# EAGLE design cwm__ (EAGLE 7.5.0)
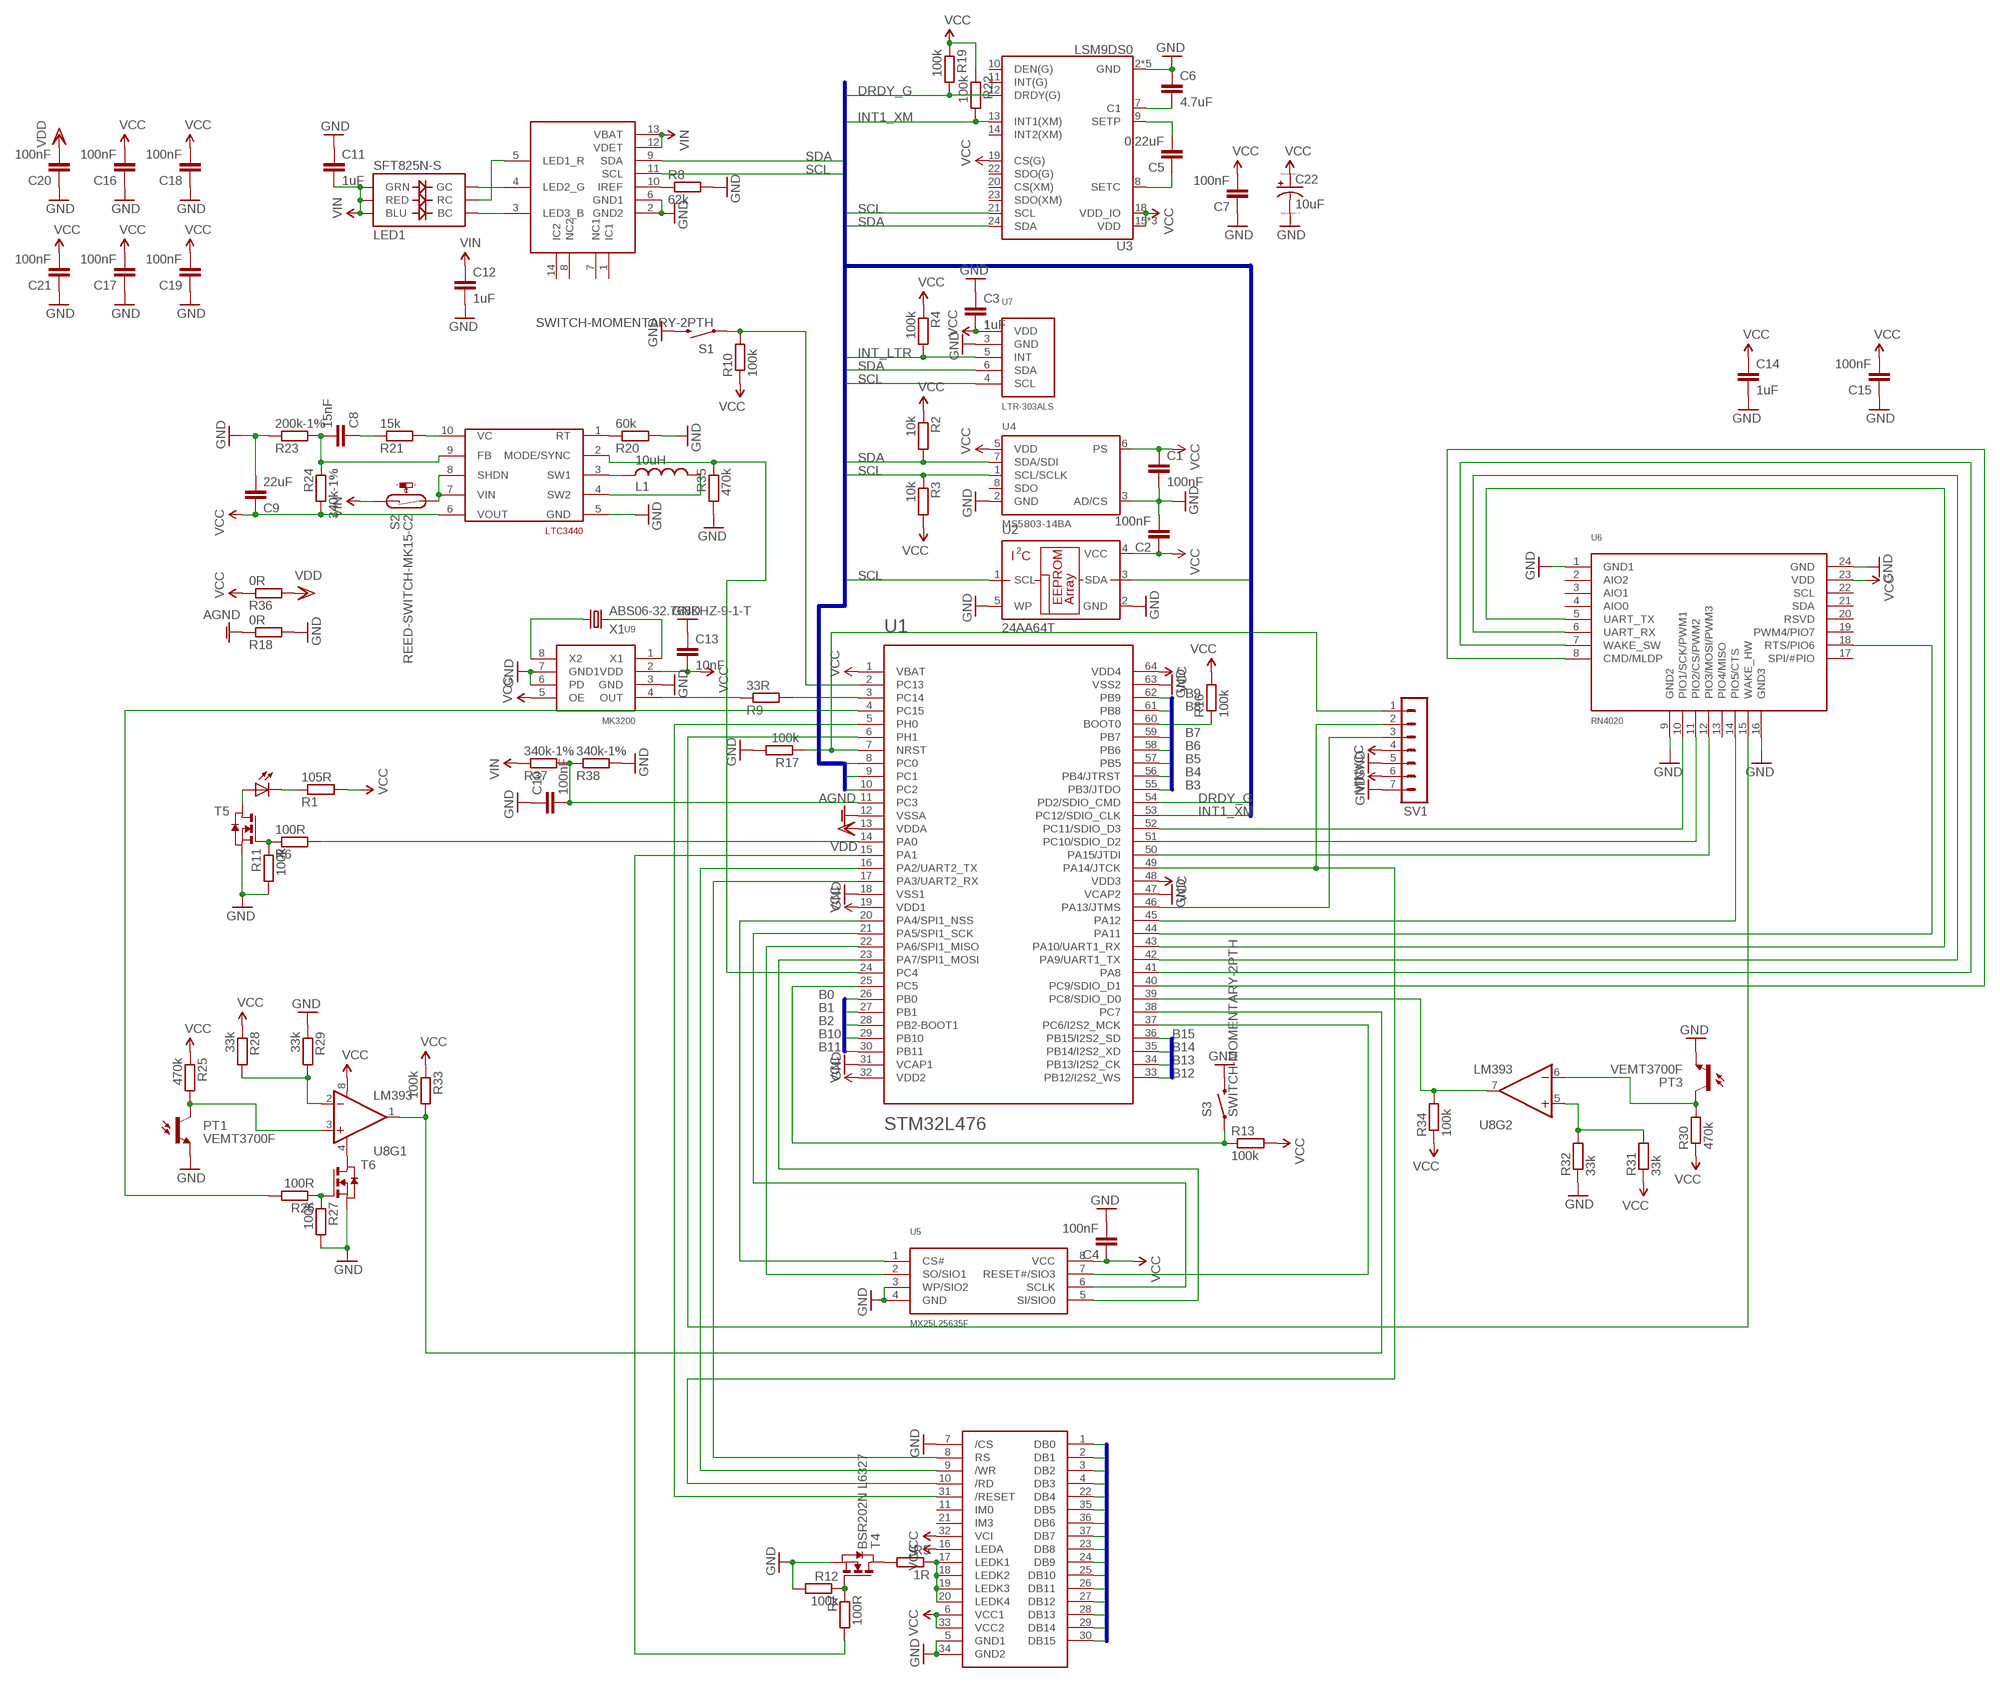
[diagram p0: schematic, sheet 1]

## Parts
C1  100nF  C-EUC0402  [C0402]
C2  100nF  C-EUC0402  [C0402]
C3  1uF  C-EUC0603  [C0603]
C4  100nF  C-EUC0402  [C0402]
C5  0.22uF  C-EUC0402  [C0402]
C6  4.7uF  C-EUC0805  [C0805]
C7  100nF  C-EUC0402  [C0402]
C8  15nF  C-EUC0402  [C0402]
C9  22uF  C-EUC0805  [C0805]
C10  100nF  C-EUC0402  [C0402]
C11  1uF  C-EUC0603  [C0603]
C12  1uF  C-EUC0603  [C0603]
C13  10nF  C-EUC0402  [C0402]
C14  1uF  C-EUC0603  [C0603]
C15  100nF  C-EUC0402  [C0402]
C16  100nF  C-EUC0402  [C0402]
C17  100nF  C-EUC0402  [C0402]
C18  100nF  C-EUC0402  [C0402]
C19  100nF  C-EUC0402  [C0402]
C20  100nF  C-EUC0402  [C0402]
C21  100nF  C-EUC0402  [C0402]
C22  10uF  CPOL-USA/3216-18R  [A/3216-18R]
L1  10uH  L-USL3225M  [L3225M]
LED1  SFT825N-S  LED-TRICOLOR-NO-COMPLCC-6-SMD  [PLCC-6-LED]
PT1  VEMT3700F  [PLCC-2]
PT3  VEMT3700F  [PLCC-2]
R1  105R  R-EU_R0402  [R0402]
R2  10k  R-EU_R0402  [R0402]
R3  10k  R-EU_R0402  [R0402]
R4  100k  R-EU_R0402  [R0402]
R5  1R  R-EU_R0402  [R0402]
R6  100R  R-EU_R0402  [R0402]
R7  100R  R-EU_R0402  [R0402]
R8  62k  R-EU_R0402  [R0402]
R9  33R  R-EU_R0402  [R0402]
R10  100k  R-EU_R0402  [R0402]
R11  100k  R-EU_R0402  [R0402]
R12  100k  R-EU_R0402  [R0402]
R13  100k  R-EU_R0402  [R0402]
R16  100k  R-EU_R0402  [R0402]
R17  100k  R-EU_R0402  [R0402]
R18  0R  R-EU_R0402  [R0402]
R19  100k  R-EU_R0402  [R0402]
R20  60k  R-EU_R0402  [R0402]
R21  15k  R-EU_R0402  [R0402]
R22  100k  R-EU_R0402  [R0402]
R23  200k-1%  R-EU_R0402  [R0402]
R24  340k-1%  R-EU_R0402  [R0402]
R25  470k  R-EU_R0402  [R0402]
R26  100R  R-EU_R0402  [R0402]
R27  100k  R-EU_R0402  [R0402]
R28  33k  R-EU_R0402  [R0402]
R29  33k  R-EU_R0402  [R0402]
R30  470k  R-EU_R0402  [R0402]
R31  33k  R-EU_R0402  [R0402]
R32  33k  R-EU_R0402  [R0402]
R33  100k  R-EU_R0402  [R0402]
R34  100k  R-EU_R0402  [R0402]
R35  470k  R-EU_R0402  [R0402]
R36  0R  R-EU_R0402  [R0402]
R37  340k-1%  R-EU_R0402  [R0402]
R38  340k-1%  R-EU_R0402  [R0402]
S1  SWITCH-MOMENTARY-2PTH  [TACTILE-PTH]
S2  REED-SWITCH-MK15-C2  [MK15]
S3  SWITCH-MOMENTARY-2PTH  [TACTILE-PTH]
SV1  MA07-1  [MA07-1]
T4  BSR202N L6327  NMOSSOT23  [SOT-23]
T5  NMOSSOT23  [SOT-23]
T6  NMOSSOT23  [SOT-23]
U1  STM32L476  STM32F405RG  [TQFP64]
U2  24AA64T  24AA00OT  [SOT23-5L]
U3  LSM9DS0  [LGA-24]
U4  MS5803-14BA  [MS5803]
U5  MX25L25635F  [WSON8L]
U6  RN4020  [RN4020]
U7  LTR-303ALS  [LTR-303ALS]
U8  LM393  [SO08]
U9  MK3200  [SOIC8]
U$1  S95466-AAA  [S95466-AAA]
U$2  VSML3710  [PLCC-2]
U$3  NCP5623  [NCP5623]
U$9  LTC3440  [MSOP10]
X1  ABS06-32.768KHZ-9-1-T  CRYSTALS-NOGND-IQXC-25  [2.0X1.2-2PAD]

## Nets
AGND: R18.1 U1.12(VSSA)
B0: U1.26(PB0) U$1.1(DB0)
B1: U1.27(PB1) U$1.2(DB1)
B2: U1.28(PB2-BOOT1) U$1.3(DB2)
B3: U1.55(PB3/JTDO) U$1.4(DB3)
B4: U1.56(PB4/JTRST) U$1.22(DB4)
B5: U1.57(PB5) U$1.35(DB5)
B6: U1.58(PB6) U$1.36(DB6)
B7: U1.59(PB7) U$1.37(DB7)
B8: U1.61(PB8) U$1.23(DB8)
B9: U1.62(PB9) U$1.24(DB9)
B10: U1.29(PB10) U$1.25(DB10)
B11: U1.30(PB11) U$1.26(DB11)
B12: U1.33(PB12/I2S2_WS) U$1.27(DB12)
B13: U1.34(PB13/I2S2_CK) U$1.28(DB13)
B14: U1.35(PB14/I2S2_XD) U$1.29(DB14)
B15: U1.36(PB15/I2S2_SD) U$1.30(DB15)
DRDY_G: R19.2 U1.54(PD2/SDIO_CMD) U3.12(DRDY(G))
GND [GND]: C1.2 C2.2 C3.1 C4.2 C6.1 C7.1 C9.2 C10.1 C11.1 C12.2 C13.1 C14.2 C15.1 C16.1 C17.1 C18.1 C19.1 C20.1 C21.1 C22.- PT1.P$2(E) PT3.P$2(E) R8.2 R11.2 R12.2 R17.2 R18.2 R20.2 R23.1 R27.2 R29.1 R32.1 R35.2 R38.2 S1.3 S3.3 SV1.5 SV1.7 T4.2(S) T5.2(S) T6.2(S) U1.18(VSS1) U1.31(VCAP1) U1.47(VCAP2) U1.63(VSS2) U2.2(GND) U2.5(WP) U3.2(GND) U3.3(GND) U3.4(GND) U3.5(GND) U3.6(GND) U4.2(GND) U4.3(AD/CS) U5.3(WP/SIO2) U5.4(GND) U6.1(GND1) U6.9(GND2) U6.16(GND3) U6.24(GND) U7.3(GND) U9.3(GND) U9.6(PD) U9.7(GND1) U$1.5(GND1) U$1.7(/CS) U$1.34(GND2) U$3.2(GND2) U$3.6(GND1) U$9.5(GND)
INT1_XM: R22.2 U1.53(PC12/SDIO_CLK) U3.13(INT1(XM))
INT_LTR: R4.2 U1.10(PC2) U7.5(INT)
N$1 [VIN]: S2.2 U$9.7(VIN) U$9.8(SHDN)
N$2: R5.1 U$1.17(LEDK1) U$1.18(LEDK2) U$1.19(LEDK3) U$1.20(LEDK4)
N$3: T5.1(D) U$2.P$2(A)
N$4: C5.2 U3.9(SETP)
N$5: U1.6(PH1) U6.15(WAKE_HW)
N$6: U1.17(PA3/UART2_RX) U$1.8(RS)
N$7: U1.5(PH0) U$1.31(/RESET)
N$8: U1.16(PA2/UART2_TX) U$1.9(/WR)
N$9: R35.1 U1.24(PC4) U$9.2(MODE/SYNC)
N$10: R5.2 T4.1(D)
N$11: LED1.CG(GC) U$3.4(LED2_G)
N$12: LED1.CB(BC) U$3.3(LED3_B)
N$13: LED1.CR(RC) U$3.5(LED1_R)
N$14: R1.1 U$2.P$1(C)
N$15: R6.1 R11.1 T5.3(G)
N$16: R6.2 U1.14(PA0)
N$17: R7.1 R12.1 T4.3(G)
N$18: R7.2 U1.15(PA1)
N$19: U9.1(X1) X1.2
N$20: R8.1 U$3.10(IREF)
N$21: U9.8(X2) X1.1
N$22: R9.1 U9.4(OUT)
N$23: SV1.2 U1.49(PA14/JTCK) U$1.10(/RD)
N$24: R10.2 S1.1 U1.2(PC13)
N$25: R13.1 S3.1 U1.25(PC5)
N$26: R9.2 U1.3(PC14)
N$27: U1.42(PA9/UART1_TX) U6.6(UART_RX)
N$28: L1.2 U$9.3(SW1)
N$29: L1.1 U$9.4(SW2)
N$30: C5.1 U3.8(SETC)
N$31: C6.2 U3.7(C1)
N$32: T6.1(D) U8.4(V-)
N$33: PT1.P$1(C) R25.2 U8.3(+IN)
N$34: R28.2 R29.2 U8.2(-IN)
N$35: R17.1 SV1.1 U1.7(NRST)
N$36: R16.1 U1.60(BOOT0)
N$37: PT3.P$1(C) R30.2 U8.6(-IN)
N$38: R26.1 R27.1 T6.3(G)
N$39: R26.2 U1.4(PC15)
N$40: R31.2 R32.2 U8.5(+IN)
N$41: R33.2 U1.38(PC7) U8.1(OUT)
N$42: R34.2 U1.39(PC8/SDIO_D0) U8.7(OUT)
N$43: U1.43(PA10/UART1_RX) U6.5(UART_TX)
N$44: U1.44(PA11) U6.18(RTS/PIO6)
N$45: U1.45(PA12) U6.14(PIO5/CTS)
N$46: U1.40(PC9/SDIO_D1) U6.8(CMD/MLDP)
N$47: U1.41(PA8) U6.7(WAKE_SW)
N$48: SV1.3 U1.46(PA13/JTMS)
N$49: U1.52(PC11/SDIO_D3) U6.10(PIO1/SCK/PWM1)
N$50: U1.51(PC10/SDIO_D2) U6.11(PIO2/CS/PWM2)
N$51: U1.50(PA15/JTDI) U6.12(PIO3/MOSI/PWM3)
N$52: R20.1 U$9.1(RT)
N$53: U1.20(PA4/SPI1_NSS) U5.1(CS#)
N$54: U1.22(PA6/SPI1_MISO) U5.2(SO/SIO1)
N$55: U1.37(PC6/I2S2_MCK) U5.7(RESET#/SIO3)
N$56: U1.21(PA5/SPI1_SCK) U5.6(SCLK)
N$57: U1.23(PA7/SPI1_MOSI) U5.5(SI/SIO0)
N$58: C10.2 R37.2 R38.1 U1.11(PC3)
N$70: C8.2 R23.2 R24.1 U$9.9(FB)
N$73: R21.2 U$9.10(VC)
N$74: C8.1 R21.1
SCL: R3.1 U1.8(PC0) U2.1(SCL) U3.21(SCL) U4.1(SCL/SCLK) U7.4(SCL) U$3.11(SCL)
SDA: R2.2 U1.9(PC1) U2.3(SDA) U3.24(SDA) U4.7(SDA/SDI) U7.6(SDA) U$3.9(SDA)
VCC [VCC]: C1.1 C2.1 C3.2 C4.1 C7.2 C9.1 C13.2 C14.1 C15.2 C16.2 C17.2 C18.2 C19.2 C21.2 C22.+ R1.2 R2.1 R3.2 R4.1 R10.1 R13.2 R16.2 R19.1 R22.1 R24.2 R25.1 R28.1 R30.1 R31.1 R33.1 R34.1 R36.1 SV1.4 U1.1(VBAT) U1.19(VDD1) U1.32(VDD2) U1.48(VDD3) U1.64(VDD4) U2.4(VCC) U3.15(VDD) U3.16(VDD) U3.17(VDD) U3.18(VDD_IO) U3.19(CS(G)) U4.5(VDD) U4.6(PS) U5.8(VCC) U6.23(VDD) U7.1(VDD) U8.8(V+) U9.2(VDD) U9.5(OE) U$1.6(VCC1) U$1.16(LEDA) U$1.32(VCI) U$1.33(VCC2) U$9.6(VOUT)
VDD: C20.2 R36.2 U1.13(VDDA)
VIN [VIN]: C11.2 C12.1 LED1.AB(BLU) LED1.AG(GRN) LED1.AR(RED) R37.1 S2.1 SV1.6 U$3.12(VDET) U$3.13(VBAT)
Unconnected: U3.10(DEN(G)) U3.11(INT(G)) U3.14(INT2(XM)) U3.20(CS(XM)) U3.22(SDO(G)) U3.23(SDO(XM)) U4.8(SDO) U6.2(AIO2) U6.3(AIO1) U6.4(AIO0) U6.13(PIO4/MISO) U6.17(SPI/#PIO) U6.19(PWM4/PIO7) U6.20(RSVD) U6.21(SDA) U6.22(SCL) U$1.11(IM0) U$1.21(IM3) U$3.1(IC1) U$3.7(NC1) U$3.8(NC2) U$3.14(IC2)

## Buses
B[0..15]
SDA,SCL,DRDY_G,INT1_XM,INT_LTR

## Library data of the parts
C1-C21 = resistor:C-EU: CAPACITOR, European symbol
C22 = resistor:CPOL-US: POLARIZED CAPACITOR, American symbol
L1 = resistor:L-US: INDUCTOR, American symbol
LED1 = SparkFun-LED:LED-TRICOLOR-NO-COM; PROD_ID: DIO-12113
PT1 PT3 = vishay_opto:VEMT3700F
R1-R13 R16-R38 = resistor:R-EU_: RESISTOR, European symbol
S1 S3 = SparkFun-Electromechanical:SWITCH-MOMENTARY-2: Various NO switches- pushbuttons, reed, etc; PROD_ID: SWCH-08441
S2 = switch-reed:REED-SWITCH-: Reed Sensor; MF: MEDER; MPN: MK15-C-2; OC_FARNELL: 1079485
SV1 = con-lstb:MA07-1: PIN HEADER; OC_FARNELL: unknown; OC_NEWARK: unknown
T4-T6 = zetex:NMOSSOT23: MOS FET; OC_FARNELL: unknown; OC_NEWARK: unknown
U1 = SparkFun-DigitalIC:STM32F405RG: ARM DSP Chip used on the WAV Trigger board.
U2 = microchip:24*00: Serial EEPROM 128 bit, I2C (AA = 1.8 V/LC = 2.5 V/C = 5.0 V); MF: MICROCHIP; MPN: 24AA00T-I/OTG; OC_FARNELL: 1331264; OC_NEWARK: 89H3038
U3 = SparkFun-DigitalIC:LSM9DS0: LSM9DS0 3D Accelerometer, 3D Gyroscope, 3D Magnetomter Features: 3 acceleration channels, 3 angular rate channels, 3 magnetic field channels ±2/±4/±6/±8/±16 g linear acceleration full scale ±2/±4/±8/±12 gauss magnetic full scale ±245/±500/±2000 dps angular rate full scale 16-bit data output SPI / I2C serial interfaces Analog supply voltage 2.4 V to 3.6 V Power-down mode / low-power mode Programmable interrupt generators Embedded self-test Embedded temperature sensor Embedded FIFO Position and motion detection functions Click/double-click recognition
U4 = MS5803:MS5803-14BA; PROD_ID: IC-12111
U5 = MX25L25635F:MX25L25635F
U6 = RN4020:RN4020
U7 = LTR_303ALS:LTR-303ALS
U8 = SparkFun-AnalogIC:LM393: Low-voltage comparator
U9 = MK3200:MK3200
U$1 = screen_37pin:S95466-AAA
U$2 = vishay_opto:VSML3710
U$3 = NCP5623:NCP5623
U$9 = SparkFun:LTC3440
X1 = IQD-Frequency-Products:CRYSTALS-NOGND: CRYSTALS CAN NOT GROUNDED

## Net classes
1 VIN: width 0.254 mm, drill 0.4 mm, clearance 0.2 mm
2 GND: width 0.254 mm, drill 0.4 mm, clearance 0.2 mm
3 VCC: width 0.254 mm, drill 0.4 mm, clearance 0.2 mm
4 VDD: width 0.254 mm, drill 0.4 mm, clearance 0.2 mm

## Board
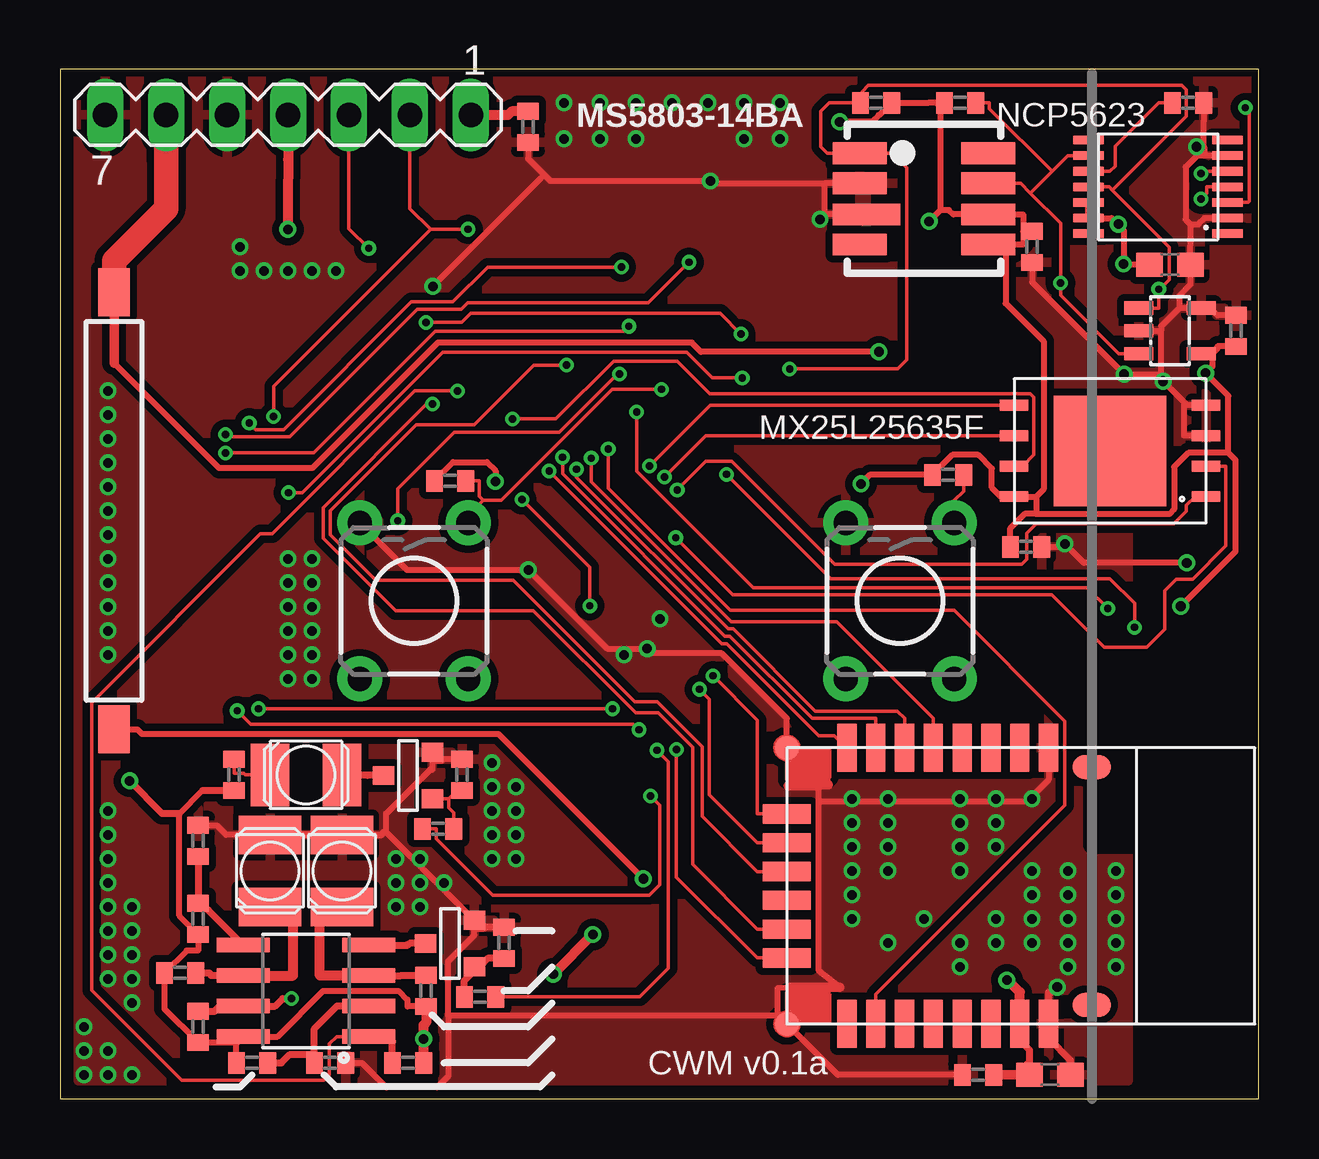
[diagram p1: board, top side]
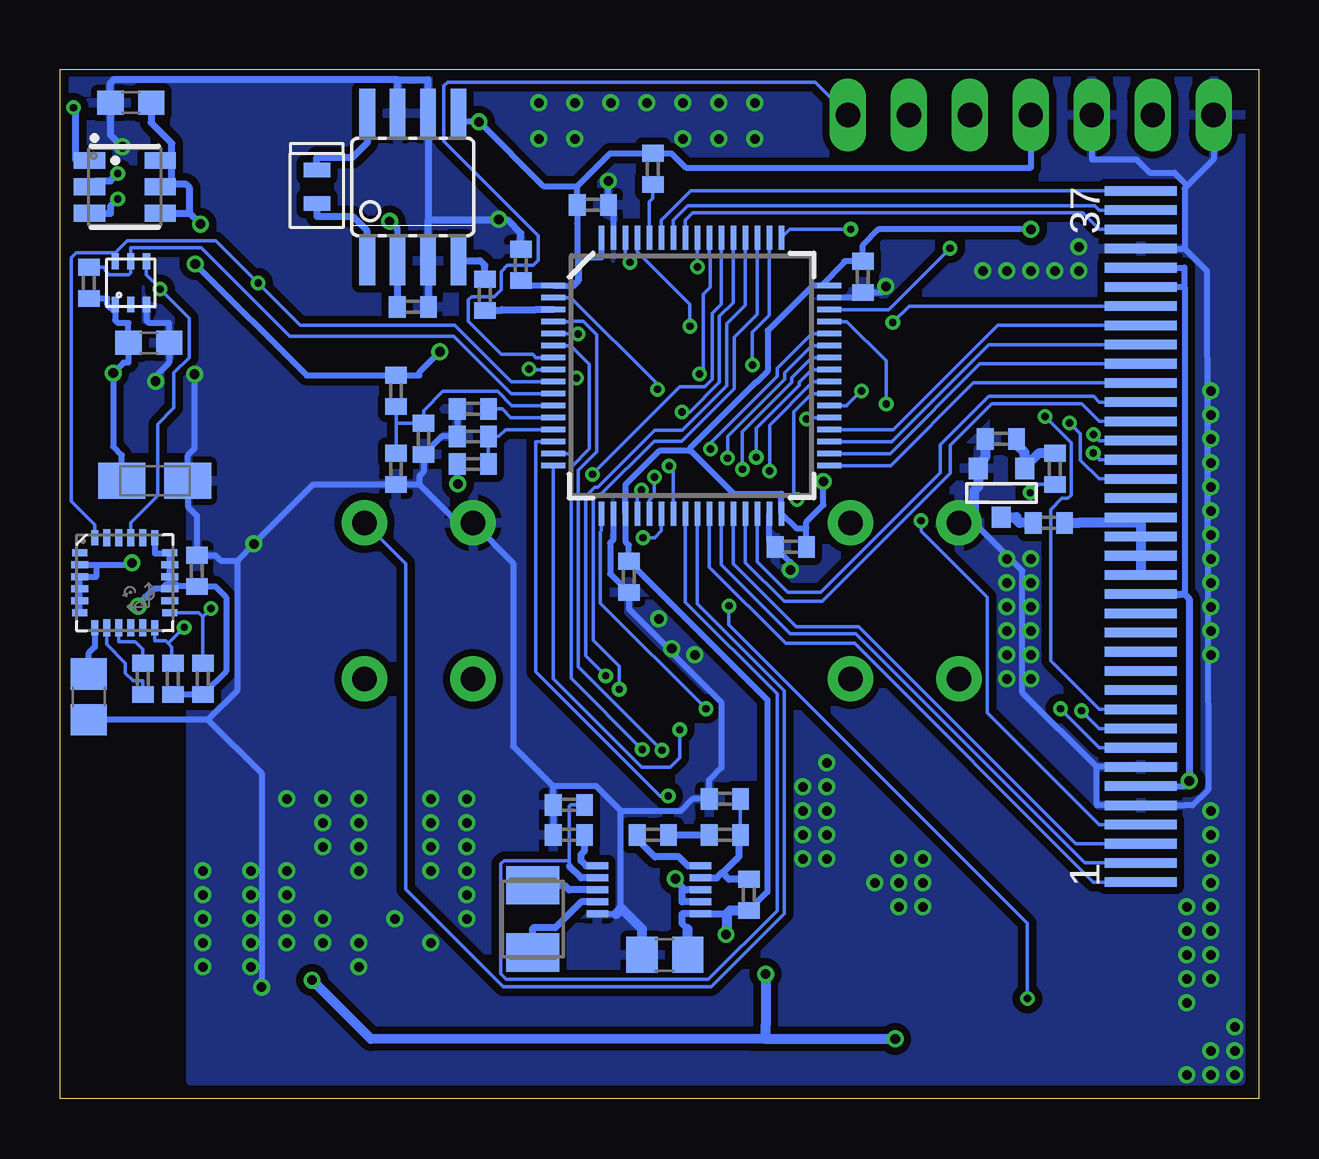
[diagram p2: board, bottom side, seen from below]

Size 49.95 x 42.9 mm. Coordinates in mm from the lower left corner, seen from the top.
Outline: 0,0 49.95,0 49.95,42.9 0,42.9 0,0
Copper layers (1*16): Top 0.035mm / dielectric 1.5mm / Bottom 0.035mm
Design rules "SeeedStudio_2layer_DRU_no_angle_20140221": minimum track width 6mil, minimum drill 12mil, track to track 6mil, track to pad 6mil, pad to pad 6mil, via to via 6mil, smd to smd 0mil, copper to edge 10mil, drill to drill 10mil, minimum pad ring 10mil, minimum via ring 6mil, stop-mask expansion 2mil, vias tented up to drill 100mil, thermal gap 10mil

### Footprints (pad centres in the part's own frame; a part is rotated, then mirrored left to right if it is on the bottom)
C0402 = smd 0.7 x 0.9: 1 -0.65,0; 2 0.65,0
C0603 = smd 1.1 x 1: 1 -0.85,0; 2 0.85,0
C0805 = smd 1.3 x 1.5: 1 -0.95,0; 2 0.95,0
A/3216-18R = smd 1.95 x 1.5: + 1.375,0; - -1.375,0
L3225M = smd 1.6 x 2.2: 1 -1.4,0; 2 1.4,0
PLCC-6-LED = smd 0.7 x 1.3: AB -1.1,1.475; AG 1.1,1.475; AR 0,1.475; CB -1.1,-1.475; CG 1.1,-1.475; CR 0,-1.475
PLCC-2 = smd 1.6 x 2.6: P$1 -1.5,0; P$2 1.5,0
R0402 = smd 0.7 x 0.9: 1 -0.65,0; 2 0.65,0
TACTILE-PTH = drill 1.016 pad 1.88: 1 -3.251,2.261; 2 3.251,2.261; 3 -3.251,-2.261; 4 3.251,-2.261
MK15 = smd 2 x 1.3: 1 -9.1,0; 2 9.1,0
MA07-1 = drill 1.016 long: 1 -7.62,0; 2 -5.08,0; 3 -2.54,0; 4 0,0; 5 2.54,0; 6 5.08,0; 7 7.62,0
SOT-23 = smd 0.787 x 0.889: 1 0.025,-1.016; 2 -0.94,1.016; 3 0.991,1.016
TQFP64 = smd 0.22 x 1: 1 -3.75,-5.75; 2 -3.25,-5.75; 3 -2.75,-5.75; 4 -2.25,-5.75; 5 -1.75,-5.75; 6 -1.25,-5.75; 7 -0.75,-5.75; 8 -0.25,-5.75; 9 0.25,-5.75; 10 0.75,-5.75; 11 1.25,-5.75; 12 1.75,-5.75; 13 2.25,-5.75; 14 2.75,-5.75; 15 3.25,-5.75; 16 3.75,-5.75; 33 3.75,5.75; 34 3.25,5.75; 35 2.75,5.75; 36 2.25,5.75; 37 1.75,5.75; 38 1.25,5.75; 39 0.75,5.75; 40 0.25,5.75; 41 -0.25,5.75; 42 -0.75,5.75; 43 -1.25,5.75; 44 -1.75,5.75; 45 -2.25,5.75; 46 -2.75,5.75; 47 -3.25,5.75; 48 -3.75,5.75 | smd 1 x 0.22: 17 5.75,-3.75; 18 5.75,-3.25; 19 5.75,-2.75; 20 5.75,-2.25; 21 5.75,-1.75; 22 5.75,-1.25; 23 5.75,-0.75; 24 5.75,-0.25; 25 5.75,0.25; 26 5.75,0.75; 27 5.75,1.25; 28 5.75,1.75; 29 5.75,2.25; 30 5.75,2.75; 31 5.75,3.25; 32 5.75,3.75; 49 -5.75,3.75; 50 -5.75,3.25; 51 -5.75,2.75; 52 -5.75,2.25; 53 -5.75,1.75; 54 -5.75,1.25; 55 -5.75,0.75; 56 -5.75,0.25; 57 -5.75,-0.25; 58 -5.75,-0.75; 59 -5.75,-1.25; 60 -5.75,-1.75; 61 -5.75,-2.25; 62 -5.75,-2.75; 63 -5.75,-3.25; 64 -5.75,-3.75
SOT23-5L = smd 0.55 x 1.2: 1 -0.95,-1.3; 2 0,-1.3; 3 0.95,-1.3; 4 0.95,1.3; 5 -0.95,1.3
LGA-24 = smd 0.635 x 0.29: 1 -1.875,1.25; 6 -1.875,-1.25; 13 1.875,-1.25; 18 1.875,1.25 | smd 0.7 x 0.29: 2 -1.875,0.75; 3 -1.875,0.25; 4 -1.875,-0.25; 5 -1.875,-0.75; 14 1.875,-0.75; 15 1.875,-0.25; 16 1.875,0.25; 17 1.875,0.75 | smd 0.29 x 0.635: 7 -1.25,-1.875; 12 1.25,-1.875; 19 1.25,1.875; 24 -1.25,1.875 | smd 0.29 x 0.7: 8 -0.75,-1.875; 9 -0.25,-1.875; 10 0.25,-1.875; 11 0.75,-1.875; 20 0.75,1.875; 21 0.25,1.875; 22 -0.25,1.875; 23 -0.75,1.875
MS5803 = smd 2.25 x 0.9: 1 -2.675,1.9; 2 -2.675,0.65; 4 -2.675,-1.9; 5 2.675,-1.9; 6 2.675,-0.65; 7 2.675,0.65; 8 2.675,1.9 | smd 2.8 x 0.9: 3 -2.4,-0.65
WSON8L = smd 1.2 x 0.45: 1 -4,1.905; 2 -4,0.635; 3 -4,-0.635; 4 -4,-1.905; 5 4,-1.905; 6 4,-0.635; 7 4,0.635; 8 4,1.905 | smd 4.7 x 4.6: P$0 0,0
RN4020 = smd 2 x 0.8: 1 0,10.9; 2 0,9.7; 3 0,8.5; 4 0,7.3; 5 0,6.1; 6 0,4.9; 7 0,3.7; 8 0,2.5; 17 11.5,2.5; 18 11.5,3.7; 19 11.5,4.9; 20 11.5,6.1; 21 11.5,7.3; 22 11.5,8.5; 23 11.5,9.7; 24 11.5,10.9 | smd 1 x 1: 9 0,0; 16 11.5,0 | smd 0.8 x 2: 10 2.75,0; 11 3.95,0; 12 5.15,0; 13 6.35,0; 14 7.55,0; 15 8.75,0 | smd 1 x 1.6: SHIELD1 0.8,12.7; SHIELD2 10.7,12.7
LTR-303ALS = smd 0.3 x 0.65: 1 -0.65,-0.9; 2 0,-0.9; 3 0.65,-0.9; 4 0.65,0.9; 5 0,0.9; 6 -0.65,0.9
SO08 = smd 0.61 x 2.21: 1 -1.905,-2.616; 2 -0.635,-2.616; 3 0.635,-2.616; 4 1.905,-2.616; 5 1.905,2.616; 6 0.635,2.616; 7 -0.635,2.616; 8 -1.905,2.616
SOIC8 = smd 0.66 x 2.032: 1 -1.905,-3.073; 2 -0.635,-3.073; 3 0.635,-3.073; 4 1.905,-3.073; 5 1.905,3.073; 6 0.635,3.073; 7 -0.635,3.073; 8 -1.905,3.073
S95466-AAA = smd 0.4 x 3: 1 -14.4,0; 2 -13.6,0; 3 -12.8,0; 4 -12,0; 5 -11.2,0; 6 -10.4,0; 7 -9.6,0; 8 -8.8,0; 9 -8,0; 10 -7.2,0; 11 -6.4,0; 12 -5.6,0; 13 -4.8,0; 14 -4,0; 15 -3.2,0; 16 -2.4,0; 17 -1.6,0; 18 -0.8,0; 19 0,0; 20 0.8,0; 21 1.6,0; 22 2.4,0; 23 3.2,0; 24 4,0; 25 4.8,0; 26 5.6,0; 27 6.4,0; 28 7.2,0; 29 8,0; 30 8.8,0; 31 9.6,0; 32 10.4,0; 33 11.2,0; 34 12,0; 35 12.8,0; 36 13.6,0; 37 14.4,0
NCP5623 = smd 1.26 x 0.36: 1 -2.9,1.95; 2 -2.9,1.3; 3 -2.9,0.65; 4 -2.9,0; 5 -2.9,-0.65; 6 -2.9,-1.3; 7 -2.9,-1.95; 8 2.9,-1.95; 9 2.9,-1.3; 10 2.9,-0.65; 11 2.9,0; 12 2.9,0.65; 13 2.9,1.3; 14 2.9,1.95
MSOP10 = smd 0.9 x 0.29: 1 -2.2,0.8; 2 -2.2,0.3; 3 -2.2,-0.2; 4 -2.2,-0.7; 5 -2.2,-1.2; 6 2.1,-1.2; 7 2.1,-0.7; 8 2.1,-0.2; 9 2.1,0.3; 10 2.1,0.8
2.0X1.2-2PAD = smd 0.6 x 1.1: 1 -0.7,0; 2 0.7,0

### Placement (x,y rotation side)
C1  40.5,35.5 270 top
C2  49,32 90 top
C3  46.25,31.5 180 bottom
C4  40.25,23 0 top
C5  46.5,17.5 90 bottom
C6  48.75,16.75 90 bottom
C7  44.25,22 270 bottom
C8  22.25,11 0 bottom
C9  24.75,6 180 bottom
C10  34.8,27.5 90 bottom
C11  47,41.5 0 bottom
C12  46.25,34.75 0 top
C13  35.25,33 180 bottom
C14  41.25,1 0 top
C15  38.25,1 0 top
C16  26.25,21.75 90 bottom
C17  27.75,37.25 180 bottom
C18  16.5,34.25 90 bottom
C19  30.75,34.75 270 bottom
C20  32.75,27.6 0 bottom
C21  19.5,23 0 bottom
C22  46,25.75 180 bottom
L1  30.25,7.5 90 bottom
LED1  47.25,38 270 bottom
PT1  11.75,9.5 90 top
PT3  8.75,9.5 90 top
R1  7.25,13.5 270 top
R2  37.5,41.5 0 top
R3  34,41.5 0 top
R4  48.75,34 90 bottom
R5  8.75,24 180 bottom
R6  15.75,11.25 180 top
R7  8.5,26.25 270 bottom
R8  47,41.5 0 top
R9  32.25,33.5 270 bottom
R10  16.25,25.75 0 top
R11  16.75,13.5 90 top
R12  10.75,27.5 180 bottom
R13  37,26 180 top
R16  25.25,38.75 90 bottom
R17  19.5,40.5 270 top
R18  32.75,28.75 180 bottom
R19  45.25,17.5 90 bottom
R20  28.75,11 180 bottom
R21  25.25,11 180 bottom
R22  44,17.5 90 bottom
R23  22.25,12.5 0 bottom
R24  21.25,8.5 270 bottom
R25  15.25,4.5 90 top
R26  17.5,4.25 0 top
R27  18.5,6.5 90 top
R28  8,1.5 0 top
R29  11.25,1.5 180 top
R30  5,5.25 0 top
R31  5.75,7.5 90 top
R32  5.75,10.75 270 top
R33  14.5,1.5 180 top
R34  5.75,3 90 top
R35  28.75,12.25 180 bottom
R36  32.75,26.45 0 bottom
R37  35.95,29.5 270 bottom
R38  35.95,26.25 270 bottom
S1  14.75,20.75 270 top
S2  2.25,24.5 270 top
S3  35,20.75 270 top
SV1  9.5,41 180 top
T4  10.75,25.25 0 bottom
T5  14.5,13.5 270 top
T6  16.25,6.5 270 top
U1  23.64,30.14 270 bottom
U2  46.25,32 270 top
U3  47.25,21.5 0 bottom
U4  36,37.5 0 top
U5  43.75,27 180 top
U6  30.29,14.62 270 top
U7  47,34 0 bottom
U8  10.25,4.5 90 top
U9  35.25,38 0 bottom
U$1  4.92,23.43 90 bottom
U$2  10.25,13.5 0 top
U$3  45.75,38 180 top
U$9  25.36,8.91 0 bottom
X1  39.25,38 270 bottom

### Tracks (layer width: path | path; a pad name or v marks a point on that pad's centre or on a via)
AGND
  Bottom 0.152: R18.1 31.52,28.75 31.16,28.39 30.12,28.39 U1.12
B0
  Bottom 0.152: U1.26 22.89,22.15 19.71,18.97 16.83,18.97 6.89,9.03 U$1.1
B1
  Bottom 0.152: U1.27 22.39,22.25 19.52,19.37 16.8,19.37 7.26,9.83 U$1.2
B2
  Bottom 0.152: U1.28 21.89,22.3 19.27,19.68 16.68,19.68 7.63,10.63 U$1.3
B3  (via drill 0.3 pad 0.61)
  Top 0.152: v23.31,30.2 23.21,30.2 20.8,27.78 16.43,27.78 14.07,25.42 v14.07,24.09
  Bottom 0.152: U1.55 22.89,35.16 22.85,35.13 22.85,33.82 23.15,33.53 23.15,30.35 v23.31,30.2 | U$1.4 6.65,11.43 11.31,16.1 11.31,20.89 14.07,23.65 v14.07,24.09
B4  (via drill 0.3 pad 0.61)
  Top 0.152: v7.88,28.17 8.16,27.89 9.33,27.89 14.64,33.2 16.38,33.2 17.83,34.66 v23.39,34.66
  Bottom 0.152: v7.88,28.17 7.43,27.71 7.43,26.61 6.65,25.83 U$1.22 | U1.56 v23.39,34.66
B5
  Bottom 0.152: U$1.35 6.65,36.23 7.33,36.92 23.59,36.92 23.89,36.62 U1.57
B6
  Bottom 0.152: U$1.36 6.65,37.03 6.84,37.22 23.79,37.22 24.39,36.62 U1.58
B7
  Bottom 0.152: U$1.37 23.68,37.83 24.89,36.62 U1.59
B8  (via drill 0.3 pad 0.61)
  Top 0.152: v6.9,26.91 10.57,26.91 15.64,31.98 23.5,31.98 v23.7,32.19
  Bottom 0.152: U1.61 25.89,35.3 23.7,33.11 v23.7,32.19 | U$1.23 6.65,26.63 6.65,26.66 v6.9,26.91
B9  (via drill 0.3 pad 0.61)
  Top 0.152: v6.89,27.68 6.99,27.58 9.57,27.58 14.88,32.9 16.71,32.9 16.98,33.17 24.52,33.17 v26.2,34.86
  Bottom 0.152: U$1.24 6.65,27.43 6.65,27.44 v6.89,27.68 | U1.62 26.39,35.04 v26.2,34.86
B10
  Bottom 0.152: U$1.25 6.65,28.23 7.38,28.96 11.13,28.96 12.87,27.23 12.87,26.06 18.2,20.73 19.78,20.73 21.39,22.34 U1.29
B11
  Bottom 0.152: U1.30 20.89,22.38 19.62,21.1 18.25,21.1 13.27,26.09 13.27,27.26 11.26,29.27 6.88,29.27 6.65,29.03 U$1.26
B12
  Bottom 0.152: U1.33 15.33,26.39 11.89,29.83 6.65,29.83 U$1.27
B13
  Bottom 0.152: U1.34 15.36,26.89 11.62,30.63 U$1.28
B14
  Bottom 0.152: U$1.29 11.25,31.43 15.29,27.39 17.16,27.39 U1.35
B15
  Bottom 0.152: U$1.30 6.65,32.23 10.88,32.23 15.22,27.89 17.16,27.89 U1.36
DRDY_G  (via drill 0.3 pad 0.61)
  Top 0.152: v44.77,19.65 44.77,20.65 43.74,21.68 32.11,21.68 v27.77,26.02
  Bottom 0.152: v27.77,26.02 24.13,29.66 23.09,29.66 22.78,29.98 22.78,32.73 22.39,33.11 22.39,35.16 U1.54 | 45.44,18.98 45.29,18.83 45.29,18.48 45.25,18.44 R19.2 | 45.44,18.98 45.55,19.08 46,19.08 U3.12 | 45.44,18.98 v44.77,19.65
GND  (via drill 0.4 pad 0.41, 0.4 pad 0.61)
  Top 0.254: 45.88,30.19 45.88,32 | 45.88,30.19 45.88,29.99 v45.97,29.9 46.94,28.92 46.94,28.91 | 45.88,30.19 v44.34,30.19 40.5,34.03 C1.2 | U2.2 45.88,32 | 46.63,32.95 45.88,32.2 45.88,32 | 46.63,32.95 46.63,33.45 47.1,33.92 C12.2 47.1,35.58 47.1,36.44 | v46.95,22.33 42.66,22.33 v41.87,23.12 41.7,23.12 41.58,23 C4.2 | 17.27,7.08 17.65,7.08 17.72,7.15 | 17.27,7.08 17.27,6.82 17.16,6.72 16.17,5.73 16.17,3.47 | 17.27,7.08 T6.2 16.55,8.16 13.59,11.12 13.59,11.89 15.42,13.72 15.52,13.72 15.52,14.08 | 16.17,3.47 | 16.17,3.47 16.17,0.94 15.71,0.48 13.6,0.48 12.58,1.5 R29.1 | 29.91,3.5 29.87,3.47 16.17,3.47 | 29.91,3.5 29.91,4.63 30.43,4.65 | 32.49,4.65 31.62,5.33 31.62,12.4 | 29.91,3.5 U6.16 32.41,1 C15.1 | U6.24 41.19,2.52 | S1.3 14.45,22.04 v19.52,22.04 22.8,18.76 v24.46,18.76 24.51,18.57 27.57,18.57 30.29,15.85 U6.9 31.9,14.23 32,13.09 | 20.18,38.49 20.43,38.24 v27.1,38.24 27.2,38.15 31.87,38.15 | 20.18,38.49 19.5,39.17 R17.2 | 20.18,38.49 v15.54,33.86 | R32.1 6.53,11.4 6.93,11 PT3.P$2 | 31.87,36.85 31.87,38.15 | 31.62,12.4 31.62,13.06 | 31.62,12.4 40.3,12.4 41.19,13.29 U6.1 | v31.67,36.65 31.87,36.85 | U4.3 31.87,36.85 | 47.69,39.3 47.39,39.3 46.91,38.82 46.91,36.63 47.1,36.44 | 47.1,36.44 47.43,36.44 47.69,36.7 U$3.2 | 46.63,32.95 U2.5 47.92,32.95 48.22,32.65 C2.2 | R11.2 15.97,14.15 15.9,14.08 15.52,14.08 | T5.2 15.52,14.08 | 47.65,39.67 v47.35,39.67 | 47.65,39.67 47.65,40.72 R8.2 | 47.69,39.3 47.69,39.63 47.65,39.67 | 46.94,28.91 46.82,28.91 46.82,27.64 U5.3 | U5.4 46.94,28.91 | U$3.6 47.69,39.3 | U4.2 31.87,38.15
  Top 0.3: R27.2 17.72,7.15 | C14.2 42.1,1.61 41.19,2.52 41.19,4.45 41.35,4.45 v41.55,4.65 | PT3.P$2 PT1.P$2 13.38,11 13.49,11.12 13.59,11.12
  Top 0.4: 30.43,4.65 32.49,4.65 | 31.62,13.06 30.34,13.06 32,13.09
  Bottom 0.254: 48.45,22.25 47.03,22.25 v46.95,22.33 | 48.45,22.25 48.45,21.75 U3.3 U3.4 U3.5 U3.6 | 42.57,22.43 v41.87,23.12 39.39,25.6 R38.2 34.97,25.6 | 42.57,22.43 43.25,22.43 43.47,22.65 C7.1 44.25,24.3 44.62,24.67 C22.- 44.62,26.83 44.34,27.11 v44.34,30.19 | 42.57,22.43 42.57,17.02 43.78,15.8 | v45.97,29.9 45.97,30.11 45.4,30.67 C3.1 45.4,32.33 46.23,32.33 46.35,32.45 U7.3 | 43.78,15.8 C6.1 | 43.78,15.8 41.55,13.57 v41.55,4.65 | 26.57,11.98 27.61,13.03 29.4,13.03 | 26.57,11.98 24.09,11.98 23.58,12.5 R23.1 22.9,13.28 22.39,13.79 22.39,16.52 24.43,18.56 v24.46,18.76 24.46,18.64 26.25,20.42 C16.1 27.03,21.88 27.03,23.17 26.89,23.3 U1.18 | 26.56,7.93 26.58,7.95 26.58,11.98 26.57,11.98 | U$9.5 26.78,7.71 | v19.52,22.04 19.52,22.37 C21.1 20.39,23.24 U1.31 | v15.54,33.86 15.72,33.67 15.72,33.6 C18.1 16.71,33.39 U1.47 | U1.63 26.89,37.04 C17.1 v27.1,38.24 | 3.09,35.43 2.17,34.5 2.12,12.89 2.77,12.23 3.09,12.23 U$1.5 6.75,12.23 6.75,13.83 | U3.2 48.45,22.25 | 6.75,13.83 9.85,16.93 9.85,22 11.85,24 S1.3 | 29.4,13.03 31.07,14.69 31.07,22.33 S3.3 33.37,24 34.97,25.6 | 29.4,13.03 R35.2 R20.2 | 2.98,38.05 3.09,37.94 3.09,35.43 | U$1.34 3.09,35.43 | U$1.7 6.75,13.83 | R18.2 33.4,27.97 C20.1 34.05,27.6 C10.1 34.8,26.12 34.97,25.95 34.97,25.6 | C13.1 34.65,33 34.65,33.08 34.62,33.29 | 2.98,38.05 1.88,39.15 SV1.7 | 2.98,38.05 3.51,38.59 4.55,38.59 5.11,39.15 6.96,39.15 SV1.5 | T4.2 11.69,26.43
  Bottom 0.3: 32.02,36.62 31.29,36.62 30.75,36.08 C19.1 | 34.62,36.62 32.02,36.62 | 32.02,36.62 v31.67,36.65 | 35.88,42.47 47.71,42.47 47.85,42.33 C11.1 47.85,40.17 v47.35,39.67 | 35.88,42.47 35.88,42.3 U9.7 | 35.88,42.47 34.62,42.47 U9.6 34.62,36.62 | 34.62,36.62 U9.3 34.62,33.29
  Bottom 0.406: 26.78,7.71 26.56,7.93 25.7,7.08 C9.2 | 11.85,24 11.85,25.33 11.69,25.49 T4.2 | R12.2 11.4,26.72 11.69,26.43
  other vias: 1,1 2,1 3,1 2,2 1,2 1,3 2,5 3,5 3,4 3,6 2,6 2,7 3,7 3,8 2,8 2,9 2,10 2,11 2,12 2,18.5 2,19.5 2,20.5 2,21.5 2,22.5 2,23.5 2,24.5 2,25.5 2,26.5 2,27.5 2,28.5 7.5,35.5 2,29.5 9.5,18.5 10.5,18.5 10.5,19.5 9.5,19.5 9.5,20.5 10.5,20.5 9.5,21.5 10.5,21.5 10.5,22.5 9.5,22.5 9.5,17.5 10.5,17.5 14,10 15,10 14,9 15,9 14,8 15,8 16,9 18,10 19,10 19,11 18,11 18,12 19,12 19,13 18,13 18,14 7.5,34.5 8.5,34.5 9.5,34.5 10.5,34.5 11.5,34.5 44,9.5 44,8.5 44,7.5 44,6.5 44,5.5 42,9.5 42,8.5 42,7.5 42,6.5 42,5.5 40.5,6.5 40.5,7.5 40.5,8.5 40.5,9.5 39,7.5 39,6.5 37.5,6.5 37.5,5.5 39,10.5 39,11.5 39,12.5 40.5,12.5 37.5,10.5 37.5,11.5 37.5,12.5 37.5,9.5 34.5,6.5 36,7.5 33,7.5 34.5,9.5 34.5,10.5 34.5,11.5 34.5,12.5 33,12.5 33,11.5 33,10.5 33,9.5 33,8.5 21,41.5 22.5,41.5 24,41.5 25.5,41.5 27,41.5 28.5,41.5 30,41.5 30,40 28.5,40 24,40 22.5,40 21,40 23.5,18.5 25,20
  pour Bottom (isolate 0.305): 0.75,0.75 44.5,0.75 44.5,14.5 44.5,27.1 49.4,27.1 49.4,42.2 49.4,42.5 0.75,42.5
  pour Top (isolate 0.305): 0.75,0.75 44.5,0.75 44.5,25.75 49.5,25.75 49.5,42.65 0.75,42.65
INT1_XM  (via drill 0.3 pad 0.61)
  Top 0.152: v24.03,28.62 24.03,26.16 28.89,21.3 42.79,21.3 v43.66,20.43
  Bottom 0.152: v24.03,28.62 23.7,28.62 22.47,29.85 22.47,32.6 21.89,33.18 21.89,35.16 U1.53 | R22.2 44,18.73 44,20.08 44.01,20.08 | 44.01,20.08 v43.66,20.43 | 44.01,20.08 44.17,20.25 44.83,20.25 U3.13
INT_LTR
  Bottom 0.152: U1.10 31.15,29.39 33.54,31.78 40.38,31.78 44.06,35.45 47,35.45 U7.5 47,34.84 47,34.42 47.08,34.35 47.9,34.35 48.07,34.52 48.07,34.65 R4.2
N$1  (via drill 0.4 pad 0.61)
  Top 0.254: v24.31,9.17 18.27,15.21 3.42,15.21 3.23,15.4 S2.2
  Bottom 0.254: 23.82,8.71 23.93,8.71
  Bottom 0.3: v24.31,9.17 24.26,9.04 23.93,8.71 24.04,8.71 24.04,8.21 U$9.7 | 23.82,8.71 23.65,8.71 U$9.8
N$2
  Bottom 0.152: U$1.20 4.92,24
  Bottom 0.406: R5.1 7.52,24 4.92,24 U$1.19 U$1.18 U$1.17
N$3
  Top 0.3: T5.1 12.81,13.47 12.79,13.5 U$2.P$2
N$4
  Bottom 0.152: C5.2 46.5,18.73 46.82,19.05 47.5,19.05 U3.9
N$5  (via drill 0.3 pad 0.61)
  Top 0.152: U6.15 29.06,5.87 25.69,9.24 v25.69,14.56
  Bottom 0.152: U1.6 28.66,31.39 27.89,30.62 27.89,27.09 28.66,26.32 28.66,17.53 v25.69,14.56
N$6  (via drill 0.3 pad 0.61)
  Top 0.152: v8.26,16.25 v23.03,16.25
  Bottom 0.152: v8.26,16.25 6.65,14.63 U$1.8 | U1.17 27.39,23.66 27.43,23.62 27.43,20.66 v23.03,16.25
N$7  (via drill 0.3 pad 0.61)
  Top 0.152: v28.37,31.87 27.51,32.73 17.12,32.73 16.74,32.35 v15.25,32.35
  Bottom 0.152: v15.25,32.35 14.57,33.03 6.65,33.03 U$1.31 | v28.37,31.87 28.64,31.87 28.66,31.89 U1.5
N$8  (via drill 0.3 pad 0.61)
  Top 0.152: v24.13,15.38 23.89,15.61 7.94,15.61 v7.39,16.17
  Bottom 0.152: v7.39,16.17 6.65,15.43 U$1.9 | U1.16 29.39,17.5 25.71,13.82 24.52,13.82 24.13,14.21 v24.13,15.38
N$9
  Bottom 0.152: 28.73,9.93 28.73,12.2 28.68,12.25 R35.1 | 28.73,9.7 28.73,9.93 | U1.24 23.89,20.7 20.07,16.88 20.07,7.84 22.93,4.97 31.35,4.97 31.58,5.21 31.58,9.8 31.45,9.93 28.73,9.93
  Bottom 0.3: U$9.2 28.24,9.21 28.73,9.7
N$10
  Bottom 0.406: T4.1 10.1,24.23 10.1,24.12 9.98,24 R5.2
N$11  (via drill 0.3 pad 0.61)
  Top 0.152: U$3.4 47.79,38 47.79,37.73 v47.55,37.49
  Bottom 0.3: LED1.CG 47.85,36.9 47.85,37.19 v47.55,37.49
N$12  (via drill 0.3 pad 0.61)
  Top 0.152: U$3.3 49.51,37.35 49.56,37.4 49.56,41.13 v49.39,41.3
  Bottom 0.3: LED1.CB 49.3,39.15 49.3,41.13 v49.39,41.3
N$13  (via drill 0.3 pad 0.61)
  Top 0.152: U$3.5 47.64,38.65 v47.54,38.56
  Bottom 0.3: LED1.CR 48.45,38.25 47.85,38.25 v47.54,38.56
N$14
  Top 0.152: R1.1 7.25,13.57 7.65,13.57 7.72,13.5 U$2.P$1
N$15
  Top 0.152: R11.1 16.53,12.85 16.19,12.51 | T5.3 16.19,12.51 | R6.1 16.4,11.93 16.19,12.14 16.19,12.51
N$16  (via drill 0.3 pad 0.61)
  Top 0.152: R6.2 15.68,11.25 15.68,10.84 18.04,8.49 24.55,8.49 24.99,8.93 24.99,12.23 v24.6,12.62
  Bottom 0.152: v24.6,12.62 24.94,12.62 30.12,17.79 30.12,27.39 U1.14
N$17
  Bottom 0.152: T4.3 9.76,26.64 | 10.1,27.28 R12.1
  Bottom 0.406: R7.1 9.18,26.9 9.44,26.64 9.76,26.64 9.76,26.94 10.1,27.28
N$18  (via drill 0.3 pad 0.61)
  Top 0.152: v28.43,30.04 27.18,30.04 26.12,31.11 15.95,31.11 10.1,25.26 v9.52,25.26
  Bottom 0.152: v9.52,25.26 9.18,25.6 R7.2 | U1.15 28.66,26.89 28.66,29.81 v28.43,30.04
N$19
  Bottom 0.3: U9.1 37.16,36.17 37.76,36.77 39.25,36.77 X1.2
N$20
  Top 0.152: R8.1 45.77,41.5 43.96,39.69 43.96,38.87 43.74,38.65 U$3.10
N$21
  Bottom 0.3: U9.8 37.16,39.83 37.76,39.23 39.25,39.23 X1.1
N$22
  Bottom 0.3: R9.1 32.25,34.73 32.45,34.93 U9.4
N$23  (via drill 0.3 pad 0.61)
  Top 0.152: 15.44,36.23 14.58,37.09 14.58,39.25 SV1.2 | 15.44,36.23 8.9,29.7 v8.9,28.43 | 15.44,36.23 v17,36.23
  Bottom 0.152: v8.9,28.43 7.82,27.34 7.82,25.15 7.95,25.02 8.2,25.02 8.68,24.55 8.68,18.26 6.65,16.23 U$1.10 | U1.49 19.55,36.23 v17,36.23
N$24  (via drill 0.3 pad 0.61)
  Top 0.152: 17.64,24.94 18.39,24.94 23.01,29.56 v25.06,29.56 | 17.64,24.94 17.48,25.11 17.48,25.75 R10.2 | S1.1 17.01,24.31 17.64,24.94
  Bottom 0.152: U1.2 28.66,33.39 25.06,29.79 v25.06,29.56
N$25
  Top 0.152: S3.1 37.26,24.93 37.65,25.32 R13.1
  Bottom 0.152: U1.25 23.39,20.63 19.76,17.01 19.76,7.71 22.81,4.67 31.48,4.67 35.55,8.74 35.55,22.29 S3.1
N$26
  Bottom 0.3: U1.3 30.12,32.89 31.53,32.89 31.57,32.85 R9.2
N$27  (via drill 0.3 pad 0.61)
  Top 0.152: v21.52,26.23 21.52,25.9 27.84,19.58 28.04,19.58 31.47,16.15 34.88,16.15 35.19,15.85 U6.6
  Bottom 0.152: v21.52,26.23 21.52,27.8 19.45,29.86 19.45,30.05 18.62,30.89 U1.42
N$28
  Bottom 0.3: L1.2 28.92,8.9 28.73,8.71 U$9.3
N$29
  Bottom 0.3: L1.1 30.25,7.13 29.32,7.13 28.24,8.21 U$9.4
N$30
  Bottom 0.152: C5.1 46.5,17.43 46.91,17.43 47.22,17.74 47.22,18.16 48,18.93 U3.8
N$31
  Bottom 0.254: C6.2 48.75,18.58 48.5,18.83 U3.7
N$32
  Top 0.3: T6.1 14.56,6.47 14.49,6.41 U8.4
N$33
  Top 0.152: 13.53,5.13 U8.3
  Top 0.3: PT1.P$1 11.8,7.57 11.7,7.62 10.83,7.46 | 13.53,5.13 14.2,5.13 14.21,5.15 R25.2
  Top 0.406: U8.3 10.83,5.13 10.83,7.46
N$34
  Top 0.152: R29.2 10.6,1.83 | 11.53,3.87 11.53,3.86
  Top 0.3: R28.2 9.23,1.5 9.56,1.83 10.6,1.83 10.6,2.93 11.53,3.86 | U8.2 11.53,3.87
N$35
  Top 0.406: R17.1 18.82,41.15 18.67,41 SV1.1
  Bottom 0.152: U1.7 30.12,30.89 30.26,31.03 31.56,31.03 32.93,32.4 32.93,33.3 32.8,33.43 31.85,33.43 31.57,33.7 31.57,34.47 31.32,34.73 30.23,34.73 30.02,34.94 30.02,35.97 33.95,39.9 33.95,42.21 33.79,42.37 18.49,42.37 SV1.1
N$36
  Bottom 0.152: R16.1 25.25,37.52 25.39,37.38 U1.60
N$37
  Top 0.152: 6.3,5.13 6.3,5.18 | 8.22,5.13 U8.6 | 8.8,7.47 8.75,7.52
  Top 0.3: U8.6 6.3,5.13 | R30.2 6.23,5.25 6.3,5.18 | PT3.P$1 8.75,7.52 | 9.72,7.46 8.8,7.47
  Top 0.406: 8.22,5.13 9.72,5.13 9.72,7.46
N$38
  Top 0.152: 17.27,5.34 T6.3 17.48,5.51
  Top 0.3: R26.1 16.85,4.93 17.27,5.34 | 17.48,5.51 17.82,5.85 R27.1
N$39  (via drill 0.3 pad 0.61)
  Top 0.152: R26.2 24.15,4.25 25.34,5.44 25.34,14.05 v24.87,14.53
  Bottom 0.152: v24.87,14.53 28.35,18.01 28.35,26.2 27.58,26.97 27.58,31.84 28.15,32.41 28.65,32.41 28.66,32.39 U1.4
N$40
  Top 0.3: U8.5 6.18,7.86 5.83,8.2 R31.2 R32.2
N$41  (via drill 0.3 pad 0.61)
  Top 0.152: v16.56,29.5 14.79,29.5 8.83,23.54 8.34,23.54 1.32,16.52 1.32,4.53 5.08,0.77 11,0.77 11.23,1 11.23,2.29 11.53,2.6 U8.1 13.75,2.6 13.8,2.53
  Top 0.3: R33.2 13.85,2.38 13.8,2.53
  Bottom 0.152: 17.16,28.89 | 17.16,28.89 v16.56,29.5 | U1.38 17.16,28.89
N$42  (via drill 0.3 pad 0.61)
  Top 0.152: v22.08,20.54 22.08,22.14 v19.24,24.97 | 6.64,3.87 U8.7 | 6.08,3.65 R34.2
  Top 0.3: U8.7 8.97,3.87 9.28,4.18 v9.64,4.18 | 6.64,3.87 6.43,3.65 6.08,3.65
  Bottom 0.152: v22.08,20.54 22.08,19.75 9.64,7.32 v9.64,4.18 | v19.24,24.97 19.38,25.11 19.38,28.63 18.62,29.39 U1.39
N$43  (via drill 0.3 pad 0.61)
  Top 0.152: v22.14,26.7 22.14,25.71 27.96,19.88 32.35,19.88 36.39,15.85 U6.5
  Bottom 0.152: v22.14,26.7 22.14,27.61 19.76,29.99 19.76,30.25 18.62,31.39 U1.43
N$44  (via drill 0.3 pad 0.61)
  Top 0.152: U6.18 33.99,4.35 41.87,12.22 41.87,15.74 37.25,20.35 27.93,20.35 22.84,25.43 v22.84,27.08
  Bottom 0.152: v22.84,27.08 22.84,27.34 20.06,30.11 20.06,30.45 18.62,31.89 U1.44
N$45  (via drill 0.3 pad 0.61)
  Top 0.152: U6.14 29.06,7.07 26.36,9.78 26.36,14.65 24.92,16.08 23.98,16.08 19.73,20.33 13.99,20.33 10.96,23.37 10.96,24.64 15.28,28.96 v15.53,28.96
  Bottom 0.152: U1.45 17.16,32.39 15.53,30.75 v15.53,28.96
N$46  (via drill 0.3 pad 0.61)
  Top 0.152: U6.8 32.27,15.14 31.62,15.14 27.79,18.97 27.57,18.97 v20.38,26.16
  Bottom 0.152: v20.38,26.16 20.38,28.07 18.62,29.84 18.62,29.89 U1.40
N$47  (via drill 0.3 pad 0.61)
  Top 0.152: v20.94,26.73 20.94,26.04 27.71,19.27 27.92,19.27 31.34,15.85 33.99,15.85 U6.7
  Bottom 0.152: v20.94,26.73 20.94,27.94 19.15,29.73 19.15,29.86 18.62,30.39 U1.41
N$48  (via drill 0.3 pad 0.61)
  Top 0.152: v12.86,35.44 12.04,36.27 12.04,39.25 SV1.3
  Bottom 0.152: U1.46 15.41,32.89 v12.86,35.44
N$49  (via drill 0.3 pad 0.61)
  Top 0.152: v27.21,17.63 29.06,15.78 29.06,11.87 U6.10
  Bottom 0.152: U1.52 21.39,33.06 22.17,32.29 22.17,29.72 24.02,27.86 25.16,27.86 27.54,25.49 27.66,25.49 28.05,25.1 28.05,18.46 v27.21,17.63
N$50  (via drill 0.3 pad 0.61)
  Top 0.152: v26.65,17.07 27.06,16.66 27.06,12.67 29.06,10.67 U6.11
  Bottom 0.152: U1.51 20.89,32.7 21.86,31.73 21.86,29.6 24.05,27.41 25.19,27.41 27.41,25.18 27.53,25.18 27.74,24.98 27.74,19.11 26.65,18.02 v26.65,17.07
N$51  (via drill 0.3 pad 0.61)
  Top 0.152: v21.1,30.57 19.75,30.57 17.25,28.08 14.85,28.08 11.27,24.51 11.27,23.5 13.15,21.61 18.88,21.61 23.95,16.54 24.89,16.54 26.75,14.68 26.75,11.78 29.06,9.47 U6.12
  Bottom 0.152: v21.1,30.57 21.1,31.95 20.39,32.66 U1.50
N$52
  Bottom 0.3: R20.1 28.1,10.32 28.24,10.18 28.24,9.92 28.03,9.71 U$9.1
N$53  (via drill 0.3 pad 0.61)
  Top 0.152: U5.1 47.29,25.09 46.92,24.72 46.92,24.48 46.4,23.96 40.67,23.96 40.27,23.57 40.27,22.48 40.07,22.27 32.27,22.27 27.98,26.56 26.91,26.56 v25.72,25.37
  Bottom 0.152: v25.72,25.37 25.72,25.29 25.89,25.12 U1.20
N$54  (via drill 0.3 pad 0.61)
  Top 0.152: v25.65,23.38 28.04,21 41.32,21 43.5,18.81 45.27,18.81 46.03,19.57 46.03,21.18 46.51,21.65 47.19,21.65 48.58,23.04 48.58,26.36 U5.2
  Bottom 0.152: v25.65,23.38 25.17,23.38 24.89,23.66 U1.22
N$55  (via drill 0.3 pad 0.61)
  Top 0.152: U5.7 40.1,26.36 40.58,26.84 40.58,29.23 40.44,29.37 27.08,29.37 25.72,30.73 23.07,30.73 20.66,28.33 v18.85,28.33
  Bottom 0.152: v18.85,28.33 18.79,28.39 18.62,28.39 U1.37
N$56  (via drill 0.3 pad 0.61)
  Top 0.152: U5.6 26.91,27.64 v25.18,25.91
  Bottom 0.152: U1.21 25.39,24.95 25.18,25.15 v25.18,25.91
N$57  (via drill 0.3 pad 0.61)
  Top 0.152: v24.57,26.37 27.1,28.91 38.92,28.91 U5.5
  Bottom 0.152: v24.57,26.37 24.39,26.19 24.39,25.12 U1.23
N$58
  Bottom 0.152: U1.11 31.12,28.89 31.7,29.48 34,29.48 34.8,28.68 C10.2 35.43,28.15 35.95,28.15 | 35.95,28.15 R37.2 | R38.1 35.95,28.15
N$70
  Bottom 0.152: C8.2 R23.2
  Bottom 0.3: 22.34,9.41 21.75,10 21.65,10.1 21.65,10.9 C8.2 | 22.34,9.41 22.08,9.15 R24.1 | 22.34,9.41 22.38,9.41 22.58,9.21 U$9.9
N$73
  Bottom 0.152: R21.2 25.87,11 25.67,10.59
  Bottom 0.3: U$9.10 23.79,9.71 24.16,10.08 25.16,10.08 25.67,10.59
N$74
  Bottom 0.3: R21.1 C8.1
SCL  (via drill 0.3 pad 0.61)
  Top 0.152: v30.4,30.41 34.9,30.41 35.28,30.79 35.28,38.8 34.68,39.4 U4.1 33.12,39.4 31.97,39.4 31.71,39.66 31.71,41.15 32.06,41.5 R3.1 33.43,41.45 33.43,41.97 33.69,42.23 46.75,42.23 46.93,42.04 46.93,40.95 43.84,37.86 | 43.84,37.86 43.71,38 U$3.11 | 43.84,37.86 46.23,35.48 46.23,34.13 45.83,33.74 v45.78,33.74 45.78,32.95 U2.1
  Bottom 0.152: v30.4,30.41 30.14,30.41 30.12,30.39 U1.8 | U3.21 47,24 45.88,25.13 45.88,28.12 45.2,28.79 45.2,30.25 44.57,30.88 44.57,32.53 v45.78,33.74 45.78,33.77 46.35,34.35 U7.4
SDA  (via drill 0.3 pad 0.61)
  Top 0.152: R2.2 38.73,41.5 38.73,41.26 41.34,38.65 | 41.34,38.65 41.99,39.3 42.07,39.3 U$3.9 | 40.44,37.74 41.34,38.65 | 40.44,37.74 40.03,38.15 U4.7 | 40.44,37.74 41.69,36.49 v41.69,33.99 41.69,33.48 44.12,31.05 U2.3
  Bottom 0.152: 47.65,35.27 47.16,35.76 43.46,35.76 v41.69,33.99 39.93,32.23 33.51,32.23 31.16,29.88 30.13,29.88 30.12,29.89 U1.9 | 47.65,35.27 49.27,35.27 49.48,35.05 49.48,24.9 48.5,23.92 U3.24 | U7.6 47.65,35.27
VCC  (via drill 0.4 pad 0.61)
  Top 0.254: 36.68,37.03 v36.22,36.56 | 36.51,41.5 36.68,41.33 36.68,37.03 | 36.68,37.03 37.04,37.03 37.22,36.85 U4.6 40.13,36.85 40.13,36.15 | v46.7,20.53 48.98,22.81 48.98,26.61 48.68,26.92 | 48.68,26.92 47.02,26.92 46.43,26.33 46.43,24.56 46.23,24.37 40.68,24.37 | 48.68,26.92 48.68,29.29 v47.73,30.24 48.01,30.52 48.01,31.05 | C2.1 48.22,31.35 48.22,31.26 48.01,31.05 | U2.4 48.01,31.05 | 36.51,41.5 36.17,41.5 R3.2 34.14,40.99 34.1,40.99 | R2.1 36.51,41.5 | v33.37,25.63 33.75,26 R13.2 37.19,26.84 38.25,26.84 38.82,26.26 38.82,25.47 39.2,25.09 U5.8 40.68,25.09 | R10.1 16.38,26.53 17.79,26.53 18.15,26.17 18.15,25.95 v18.14,25.72 | 5.93,12.85 4.97,11.89 4.97,7.63 R31.1 5.75,6.17 5.27,6.17 R30.1 4.35,3.75 R34.1 6.79,2.35 | R25.1 14.47,3.85 14.47,4.13 14.11,4.5 10.97,4.5 9.07,2.6 U8.8 7.39,2.35 6.79,2.35 | v15.15,2.5 15.15,3 15.15,3.07 | 6.79,2.35 7.28,2.35 7.35,2.28 R28.1 | 39.4,35.6 39.4,33.15 40.98,31.57 40.98,25.4 40.68,25.09 | 34.1,40.99 | 34.1,40.99 33.82,40.7 v32.49,40.7 | 39.4,35.6 40.13,35.6 40.13,36.15 | U4.5 39.4,35.6 | 39.99,2.44 U6.23 | 40.68,24.37 40.2,24.37 39.6,23.78 C4.1 | 40.68,25.09 40.68,24.37 | 40.34,1.41 40.4,1.41 C14.1 | 40.13,36.15 C1.1
  Top 0.3: 5.93,12.85 R1.2 | 4.97,11.89 4.26,11.89 v2.9,13.25 | 39.99,2.44 40.4,2.03 40.4,1.41
  Top 0.4: C15.2 39.93,1 40.34,1.41 | v39.45,4.95 39.49,4.95
  Top 0.406: SV1.4 9.5,39.15 9.5,37.5 v9.5,36.23 | R25.1 15.25,3.17 15.15,3.07 | R33.1 v15.15,2.5 15.15,3 | U6.23 39.99,4.45 39.49,4.95 | v22.2,6.85 v20.55,5.2
  Bottom 0.254: U9.2 35.88,36.27 35.92,36.27 | C22.+ 47.38,26.83 47.73,27.18 v47.73,30.24 47.3,30.67 47.1,30.67 C3.2 47.1,32.33 47.53,32.33 47.65,32.45 47.65,32.77 | 35.88,33.04 36.1,32.83 C13.2 | R24.2 20.47,8.63 20.47,16.62 C16.2 26.25,22.71 26.25,23.08 26.39,23.22 U1.19 26.39,25.22 26.39,25.59 24.98,27 23.75,27 23.71,27.05 | 23.71,27.05 21.88,25.22 19.89,25.22 U1.32 19.28,23.78 18.85,23.78 | 23.71,27.05 23.71,27.11 20.95,29.86 20.92,29.86 20.47,30.31 20.47,32.01 18.59,33.89 18.24,33.89 | R36.1 33.4,25.9 v33.37,25.63 | SV1.4 9.5,38.8 23.87,38.8 24.47,39.4 R16.2 27.03,39.4 28.4,38.03 | v9.5,36.23 9.65,36.22 15.85,36.22 16.5,35.58 C18.2 17.28,34.9 17.28,34.85 18.24,33.89 | 28.56,33.89 U1.1 30.42,33.89 | 18.85,23.78 18.85,24.04 18.14,24.75 v18.14,25.72 | C21.2 18.85,23.78 | 3.21,21.03 3.09,21.03 3.09,33.83 | U$1.6 3.09,13.03 3.09,13.05 v2.9,13.25 | 3.09,33.83 3.21,33.83 U$1.32 | 3.09,33.83 3.09,34.63 U$1.33 | 28.4,38.03 C17.2 28.4,36.47 28.4,35.1 28.36,35.06 27.39,35.06 U1.64 | 28.4,38.03 29.81,38.03 v32.49,40.7 33.34,40.7 U9.5 | v46.7,20.53 46.7,20.61 46.05,21.25 45.71,21.25 | U1.48 18.24,33.89 | R4.1 47.97,33.35 47.97,33.1 47.65,32.77 | U7.1 47.65,32.77 | 45.38,21.45 45.12,21.45 45.03,21.35 C7.2 43.47,21.35 43.02,20.9 43.02,17.83 R22.1 44.47,16.85 R19.1 | 45.71,21.25 45.52,21.45 45.38,21.45 | 45.38,21.45 U3.16 U3.17 45.4,22.27 45.4,22.73 | U3.15 45.71,21.25 | 45.4,22.73 U3.18 | 45.4,22.73 46,22.73 U3.19 | 30.63,34.1 C19.2
  Bottom 0.3: v36.22,36.56 35.92,36.27 | 35.88,33.04 U9.2 | 28.36,35.06 28.36,34.09 28.56,33.89 | 3.09,21.03 2.9,20.84 v2.9,13.25 | U$1.16 3.21,21.03 | 23.8,7.08 24.04,7.31 24.04,7.71 U$9.6 22.17,7.71 | 30.42,33.89 30.63,34.1
  Bottom 0.4: 22.17,6.88 v22.2,6.85 | 37,2.5 21.1,2.5 20.55,2.5 | 21.6,7.85 R24.2
  Bottom 0.406: C9.1 23.8,7.08 | 22.17,6.88 22.17,7.71 22.03,7.85 21.6,7.85 | v15.15,2.5 20.55,2.5 20.55,3.05 v20.55,5.2 | 37,2.5 v39.45,4.95
VDD
  Bottom 0.152: U1.13 30.12,27.89 31.38,27.89 31.67,27.6 C20.2 R36.2
VIN  (via drill 0.4 pad 0.61)
  Top 0.254: v34.12,31.13 26.71,31.13 26.32,31.51 15.74,31.51 10.51,26.28 6.63,26.28 2.25,30.66 | 44.2,36.3 v44.1,36.45 | 44.2,36.3 44.31,36.19 v44.31,34.79 44.49,34.79 44.52,34.75 C12.1 | 44.2,36.3 43.81,36.7 U$3.13 U$3.12
  Top 0.4: 2.25,30.66 S2.1
  Top 1.016: S2.1 2.25,34.93 4.42,37.1 4.42,39.15 SV1.6
  Bottom 0.254: v34.12,31.13 34.97,30.28 34.97,30.15 R37.1 39.68,30.15 v44.31,34.79 | LED1.AB 45.29,39.1 | 45.3,38.1 45.29,38 LED1.AR
  Bottom 0.3: 44.55,36.9 v44.1,36.45 | 45.29,38 45.29,39.1 45.29,39.81 46.15,40.67 C11.2 | 44.55,36.9 44.55,37.96 44.69,38.1 45.3,38.1 | LED1.AG 44.55,36.9

### Text on the board
tPlace: CWM v0.1a